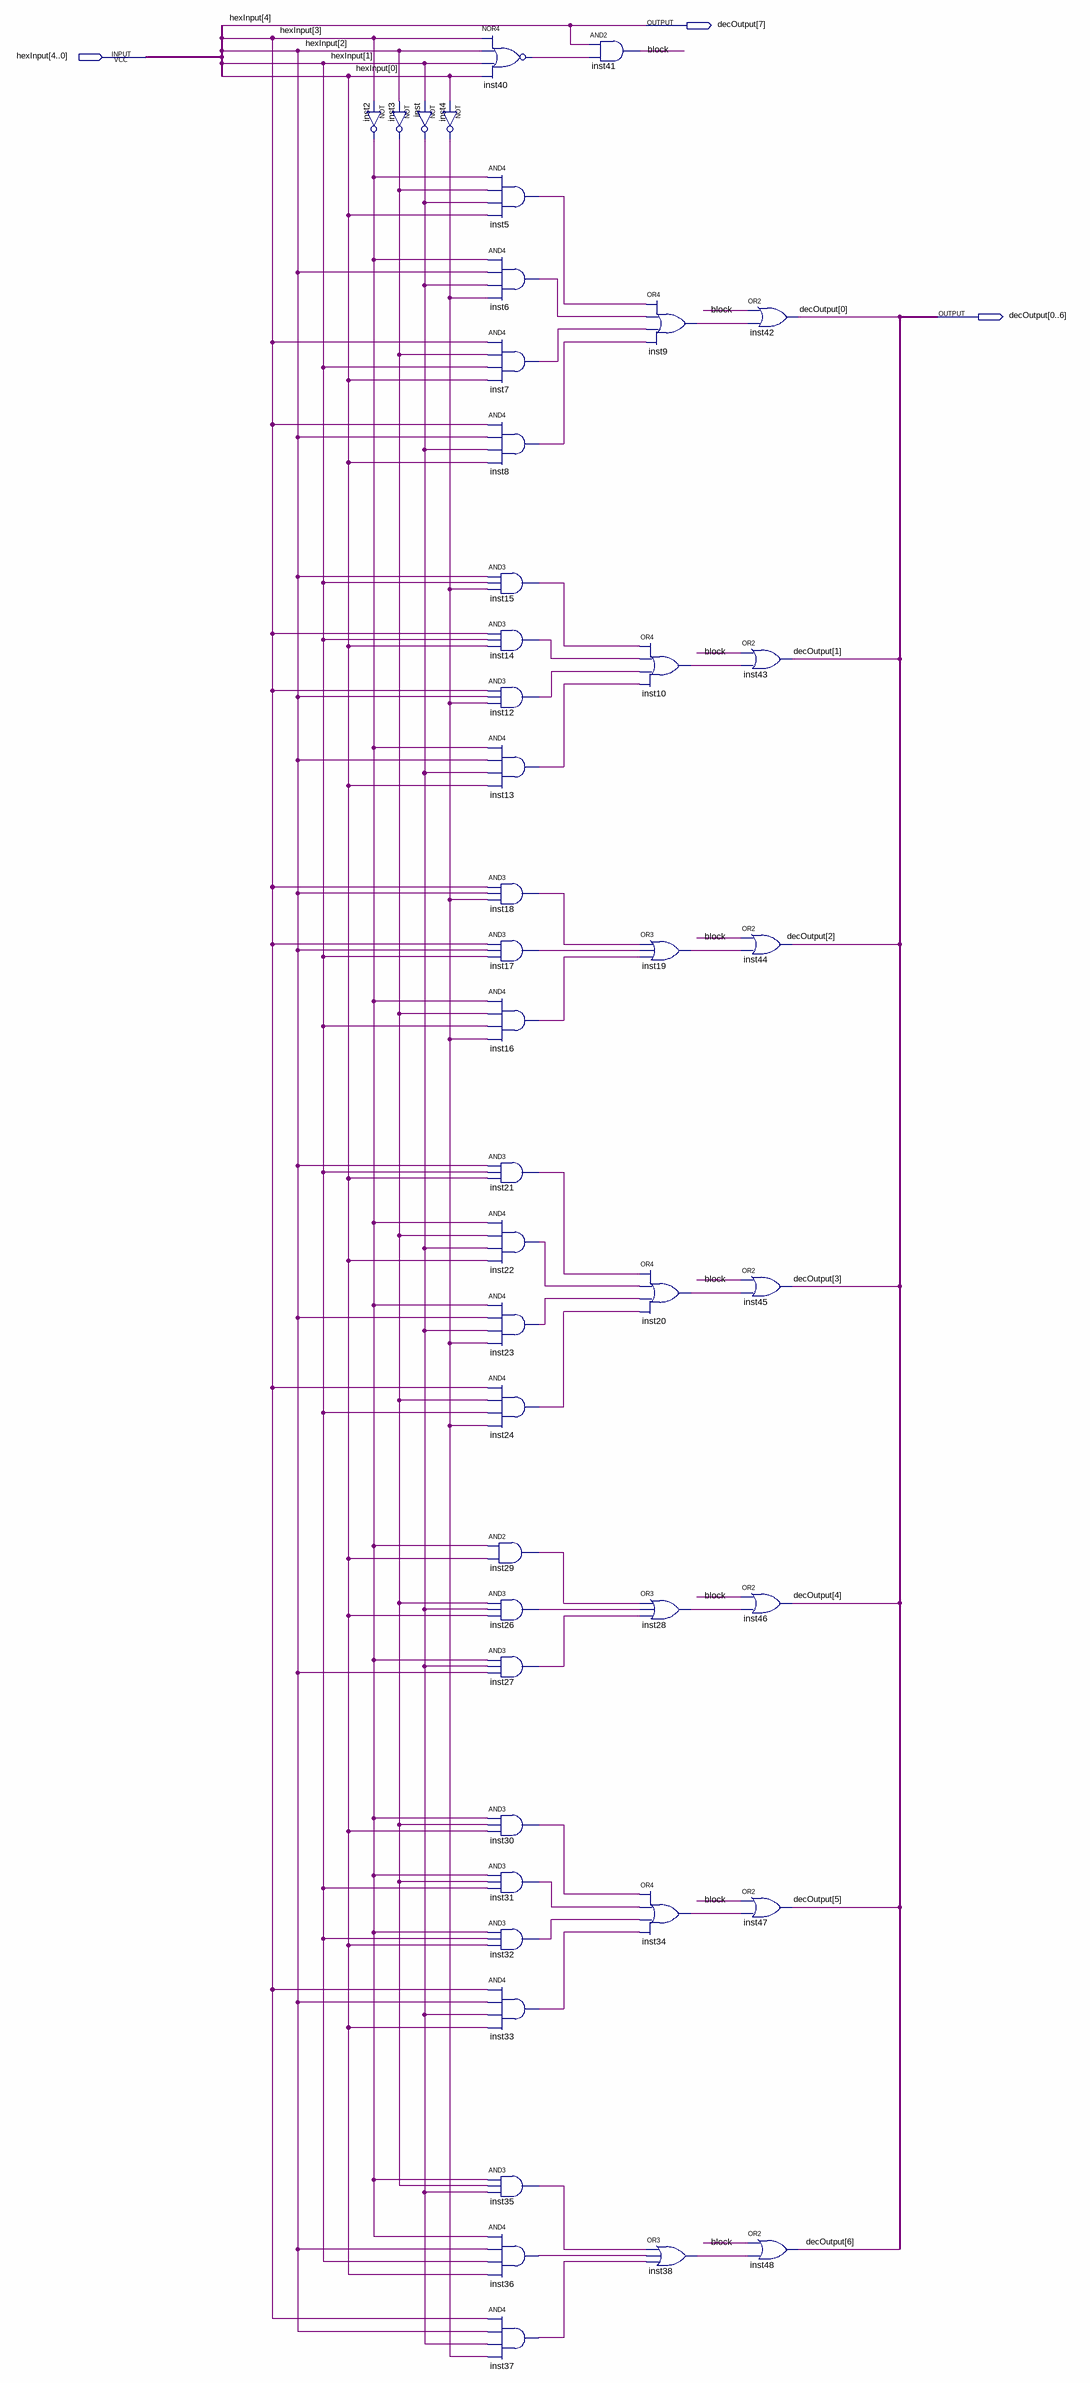
[diagram p0: schematic sheet]
// Quartus schematic Hex.bdf as structural Verilog: 45 symbols, 3 pins
module Hex (
  input  [4:0] hexInput,
  output [0:7] decOutput
);

  wire block, inst2_out, inst3_out, inst4_out, inst5_out, inst6_out, inst7_out, inst8_out, inst9_out,
       inst10_out, inst12_out, inst13_out, inst14_out, inst15_out, inst16_out, inst17_out, inst18_out,
       inst19_out, inst20_out, inst21_out, inst22_out, inst23_out, inst24_out, inst26_out, inst27_out,
       inst28_out, inst29_out, inst30_out, inst31_out, inst32_out, inst33_out, inst34_out, inst35_out,
       inst36_out, inst37_out, inst38_out, inst40_out, inst_out;

  not inst2 (inst2_out, hexInput[3]);
  not inst3 (inst3_out, hexInput[2]);
  not inst (inst_out, hexInput[1]);
  not inst4 (inst4_out, hexInput[0]);
  nor inst40 (inst40_out, hexInput[3], hexInput[2], hexInput[1], hexInput[0]);
  and inst5 (inst5_out, inst2_out, inst3_out, inst_out, hexInput[0]);
  and inst6 (inst6_out, inst2_out, hexInput[2], inst_out, inst4_out);
  and inst7 (inst7_out, hexInput[3], inst3_out, hexInput[1], hexInput[0]);
  and inst8 (inst8_out, hexInput[3], hexInput[2], inst_out, hexInput[0]);
  and inst15 (inst15_out, hexInput[2], hexInput[1], inst4_out);
  and inst14 (inst14_out, hexInput[3], hexInput[1], hexInput[0]);
  and inst12 (inst12_out, hexInput[3], hexInput[2], inst4_out);
  and inst13 (inst13_out, inst2_out, hexInput[2], inst_out, hexInput[0]);
  and inst18 (inst18_out, hexInput[3], hexInput[2], inst4_out);
  and inst17 (inst17_out, hexInput[3], hexInput[2], hexInput[1]);
  and inst16 (inst16_out, inst2_out, inst3_out, hexInput[1], inst4_out);
  and inst21 (inst21_out, hexInput[2], hexInput[1], hexInput[0]);
  and inst22 (inst22_out, inst2_out, inst3_out, inst_out, hexInput[0]);
  and inst23 (inst23_out, inst2_out, hexInput[2], inst_out, inst4_out);
  and inst24 (inst24_out, hexInput[3], inst3_out, hexInput[1], inst4_out);
  and inst29 (inst29_out, inst2_out, hexInput[0]);
  and inst26 (inst26_out, inst3_out, inst_out, hexInput[0]);
  and inst27 (inst27_out, inst2_out, inst_out, hexInput[2]);
  and inst30 (inst30_out, inst2_out, inst3_out, hexInput[0]);
  and inst31 (inst31_out, inst2_out, inst3_out, hexInput[1]);
  and inst32 (inst32_out, inst2_out, hexInput[1], hexInput[0]);
  and inst33 (inst33_out, hexInput[3], hexInput[2], inst_out, hexInput[0]);
  and inst35 (inst35_out, inst2_out, inst3_out, inst_out);
  and inst36 (inst36_out, inst2_out, hexInput[2], hexInput[1], hexInput[0]);
  and inst37 (inst37_out, hexInput[3], hexInput[2], inst_out, inst4_out);
  and inst41 (block, hexInput[4], inst40_out);
  or inst9 (inst9_out, inst5_out, inst6_out, inst7_out, inst8_out);
  or inst10 (inst10_out, inst15_out, inst14_out, inst12_out, inst13_out);
  or inst19 (inst19_out, inst18_out, inst17_out, inst16_out);
  or inst20 (inst20_out, inst21_out, inst22_out, inst23_out, inst24_out);
  or inst28 (inst28_out, inst29_out, inst26_out, inst27_out);
  or inst34 (inst34_out, inst30_out, inst31_out, inst32_out, inst33_out);
  or inst38 (inst38_out, inst35_out, inst36_out, inst37_out);
  or inst42 (decOutput[0], block, inst9_out);
  or inst43 (decOutput[1], block, inst10_out);
  or inst44 (decOutput[2], block, inst19_out);
  or inst45 (decOutput[3], block, inst20_out);
  or inst46 (decOutput[4], block, inst28_out);
  or inst47 (decOutput[5], block, inst34_out);
  or inst48 (decOutput[6], block, inst38_out);

  assign decOutput[7] = hexInput[4];
endmodule
